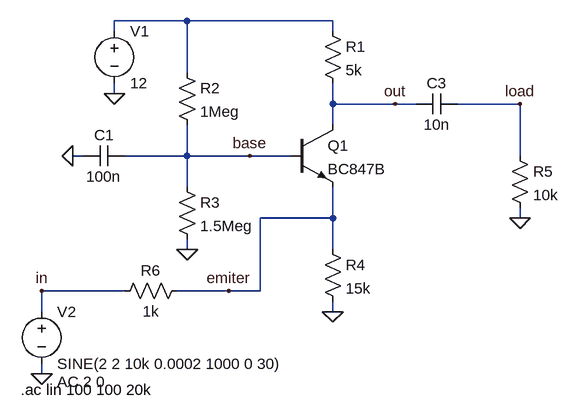
[diagram p0: schematic OB_npn_amp.asc]
OB_npn_amp.asc, the LTspice schematic file:
Version 4
SHEET 1 880 680
WIRE 32 -48 -80 -48
WIRE 256 -48 32 -48
WIRE -80 -32 -80 -48
WIRE 256 -32 256 -48
WIRE 32 32 32 -48
WIRE -80 64 -80 48
WIRE 256 80 256 48
WIRE 352 80 256 80
WIRE 384 80 352 80
WIRE 544 80 448 80
WIRE 256 112 256 80
WIRE -128 160 -144 160
WIRE 32 160 32 112
WIRE 32 160 -64 160
WIRE 128 160 32 160
WIRE 192 160 128 160
WIRE 544 160 544 80
WIRE 32 208 32 160
WIRE 256 256 256 208
WIRE 256 256 144 256
WIRE 544 256 544 240
WIRE 32 304 32 288
WIRE 256 304 256 256
WIRE -64 368 -192 368
WIRE 96 368 16 368
WIRE 144 368 144 256
WIRE 144 368 96 368
WIRE -192 400 -192 368
WIRE 256 400 256 384
WIRE -192 496 -192 480
FLAG -144 160 0
FLAG 32 304 0
FLAG 256 400 0
FLAG 544 256 0
FLAG -80 64 0
FLAG -192 496 0
FLAG 352 80 out
FLAG -192 368 in
FLAG 128 160 base
FLAG 544 80 load
FLAG 96 368 emiter
SYMBOL npn 192 112 R0
SYMATTR InstName Q1
SYMATTR Value BC847B
SYMBOL res 240 -48 R0
SYMATTR InstName R1
SYMATTR Value 5k
SYMBOL res 16 16 R0
SYMATTR InstName R2
SYMATTR Value 1Meg
SYMBOL res 16 192 R0
SYMATTR InstName R3
SYMATTR Value 1.5Meg
SYMBOL res 240 288 R0
SYMATTR InstName R4
SYMATTR Value 15k
SYMBOL res 528 144 R0
SYMATTR InstName R5
SYMATTR Value 10k
SYMBOL cap -64 144 R90
WINDOW 0 0 32 VBottom 2
WINDOW 3 32 32 VTop 2
SYMATTR InstName C1
SYMATTR Value 100n
SYMBOL cap 448 64 R90
WINDOW 0 0 32 VBottom 2
WINDOW 3 32 32 VTop 2
SYMATTR InstName C3
SYMATTR Value 10n
SYMBOL voltage -80 -48 R0
WINDOW 123 0 0 Left 0
WINDOW 39 0 0 Left 0
SYMATTR InstName V1
SYMATTR Value 12
SYMBOL voltage -192 384 R0
WINDOW 123 24 124 Left 2
WINDOW 39 24 124 Left 2
SYMATTR Value2 AC 2 0
SYMATTR InstName V2
SYMATTR Value SINE(2 2 10k 0.0002 1000 0 30)
SYMBOL res 32 352 R90
WINDOW 0 0 56 VBottom 2
WINDOW 3 32 56 VTop 2
SYMATTR InstName R6
SYMATTR Value 1k
TEXT -224 520 Left 2 !.ac lin 100 100 20k

The netlist it stands for:
* OB_npn_amp.asc
Q1 out base emiter 0 BC847B
R1 N001 out 5k
R2 N001 base 1Meg
R3 base 0 1.5Meg
R4 emiter 0 15k
R5 load 0 10k
C1 base 0 100n
C3 load out 10n
V1 N001 0 12
V2 in 0 SINE(2 2 10k 0.0002 1000 0 30) AC 2 0
R6 emiter in 1k
.model NPN NPN
.model PNP PNP
.lib standard.bjt
.ac lin 100 100 20k
.backanno
.end